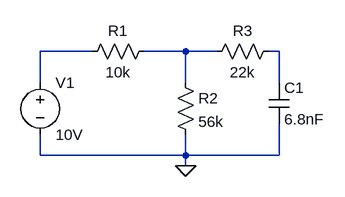
[diagram p0: schematic 2.1.asc]
2.1.asc, the LTspice schematic file:
Version 4
SHEET 1 880 680
WIRE 16 80 -64 80
WIRE 160 80 96 80
WIRE 208 80 160 80
WIRE 304 80 288 80
WIRE -64 128 -64 80
WIRE 160 128 160 80
WIRE 304 128 304 80
WIRE -64 240 -64 208
WIRE 160 240 160 208
WIRE 160 240 -64 240
WIRE 304 240 304 192
WIRE 304 240 160 240
WIRE 160 256 160 240
FLAG 160 256 0
SYMBOL cap 288 128 R0
SYMATTR InstName C1
SYMATTR Value 6.8nF
SYMBOL res 144 112 R0
SYMATTR InstName R2
SYMATTR Value 56k
SYMBOL res 304 64 R90
WINDOW 0 0 56 VBottom 2
WINDOW 3 32 56 VTop 2
SYMATTR InstName R3
SYMATTR Value 22k
SYMBOL res 112 64 R90
WINDOW 0 0 56 VBottom 2
WINDOW 3 32 56 VTop 2
SYMATTR InstName R1
SYMATTR Value 10k
SYMBOL voltage -64 112 R0
SYMATTR InstName V1
SYMATTR Value 10V

The netlist it stands for:
* 2.1.asc
C1 N003 0 6.8nF
R2 N002 0 56k
R3 N003 N002 22k
R1 N002 N001 10k
V1 N001 0 10V
.backanno
.end